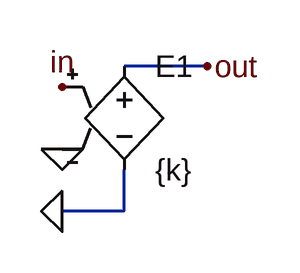
[diagram p0: schematic gain.asc]
gain.asc, the LTspice schematic file:
Version 4
SHEET 1 880 680
WIRE 304 112 240 112
WIRE 240 224 240 192
WIRE 240 224 192 224
FLAG 192 128 in
FLAG 192 224 0
FLAG 304 112 out
FLAG 192 176 0
SYMBOL e 240 96 R0
SYMATTR InstName E1
SYMATTR Value {k}

The netlist it stands for:
* gain.asc
E1 out 0 in 0 {k}
.backanno
.end